# EAGLE schematic multiSPIschematic (EAGLE 9.1.0)
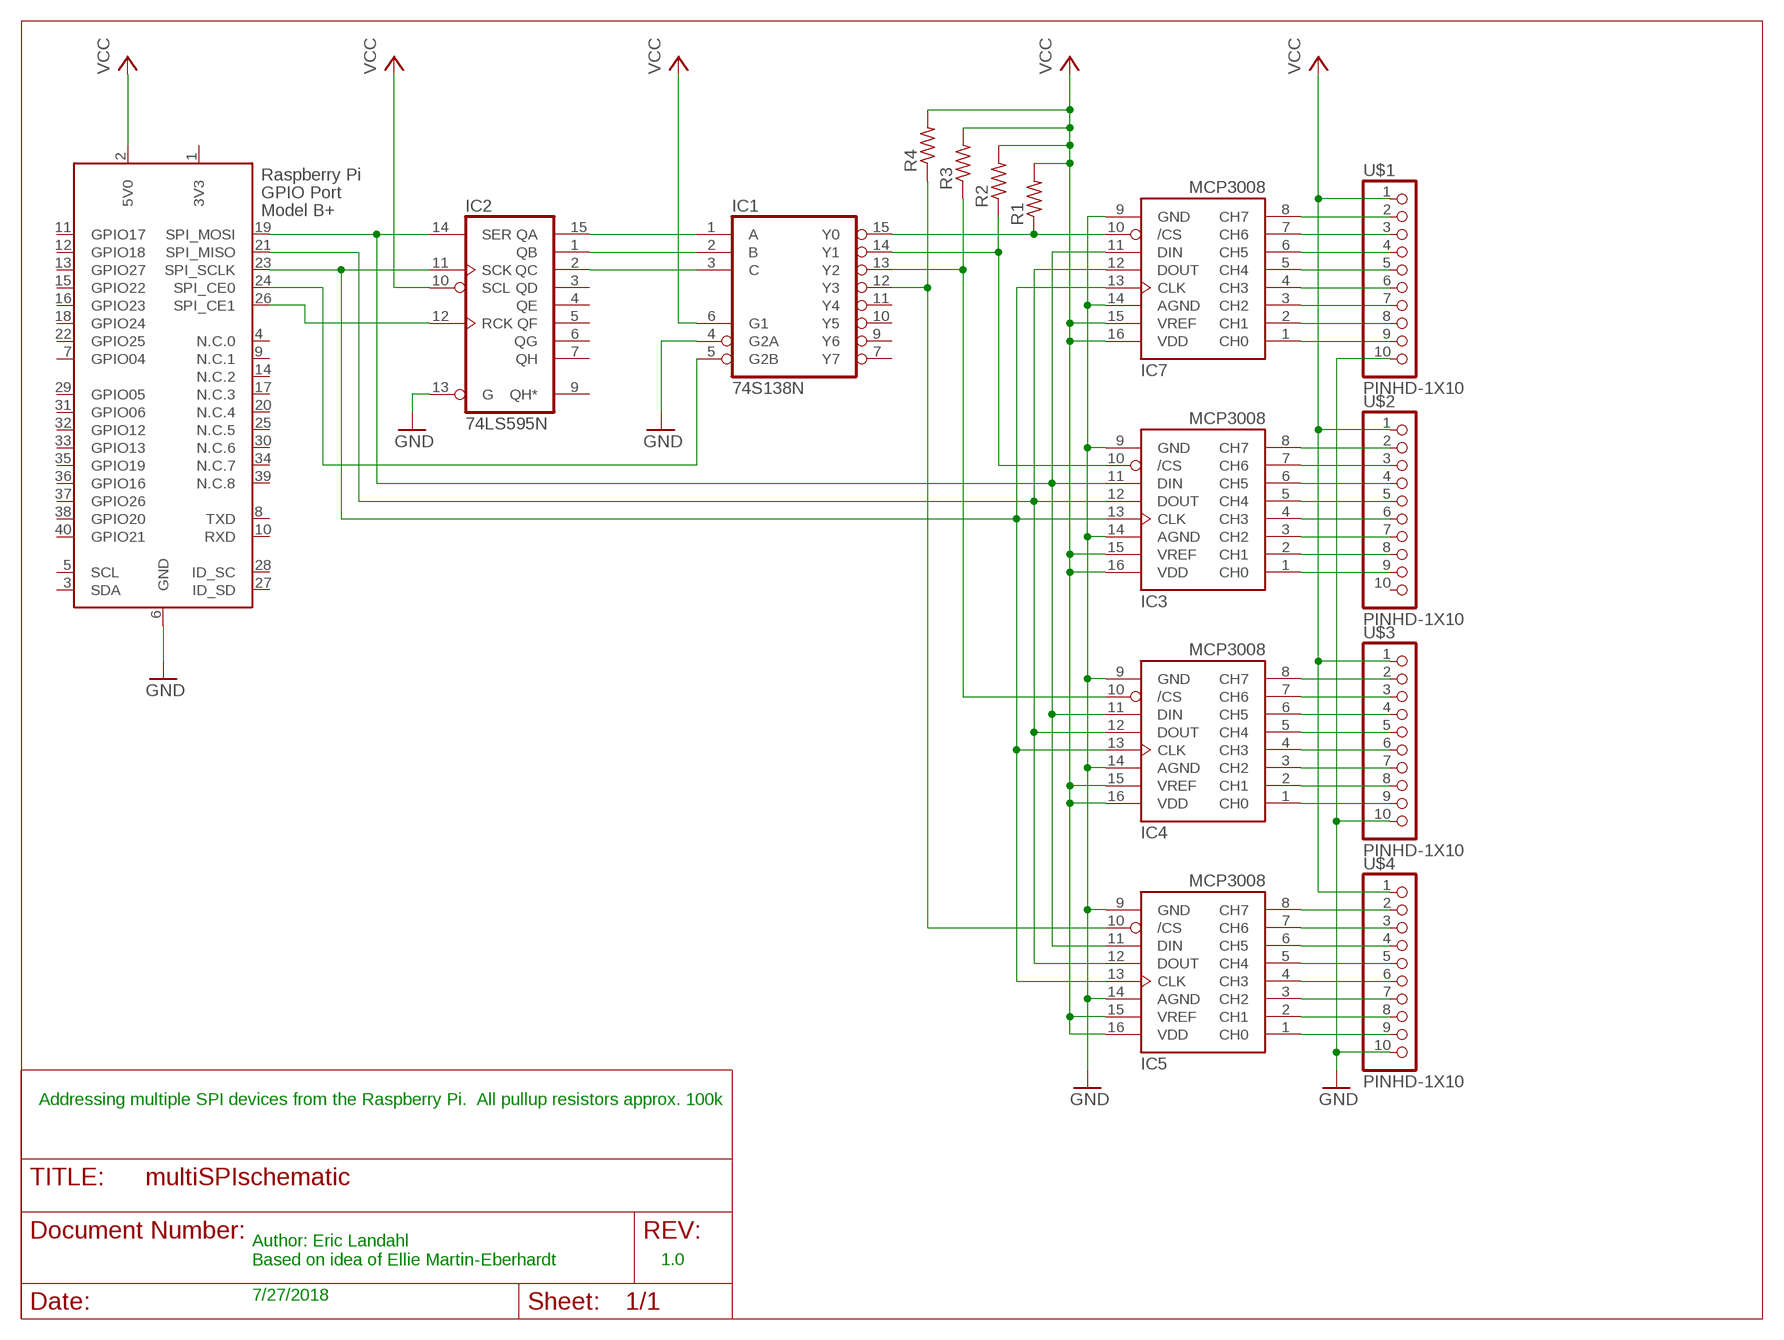
[diagram p0: schematic, sheet 1]

## Parts
IC1  74S138N  [DIL16]
IC2  74LS595N  [DIL16]
IC3  MCP3008  [DIL16]
IC4  MCP3008  [DIL16]
IC5  MCP3008  [DIL16]
IC7  MCP3008  [DIL16]
R1  R-US_0207/10  [0207/10]
R2  R-US_0207/10  [0207/10]
R3  R-US_0207/10  [0207/10]
R4  R-US_0207/10  [0207/10]
U$1  PINHD-1X10  [1X10-BIG]
U$2  PINHD-1X10  [1X10-BIG]
U$3  PINHD-1X10  [1X10-BIG]
U$4  PINHD-1X10  [1X10-BIG]
X1  RASPI_GPIO_B+_BOX  [RASPI_GPIO_B+_BOX]

## Nets
GND: IC1.4(G2A) IC2.13(G) IC3.9(GND) IC3.14(AGND) IC4.9(GND) IC4.14(AGND) IC5.9(GND) IC5.14(AGND) IC7.9(GND) IC7.14(AGND) U$1.10 U$3.10 U$4.10 X1.6(GND)
N$1: IC1.1(A) IC2.15(QA)
N$2: IC1.2(B) IC2.1(QB)
N$3: IC1.3(C) IC2.2(QC)
N$4: IC2.11(SCK) IC3.13(CLK) IC4.13(CLK) IC5.13(CLK) IC7.13(CLK) X1.23(SPI_SCLK)
N$5: IC3.12(DOUT) IC4.12(DOUT) IC5.12(DOUT) IC7.12(DOUT) X1.21(SPI_MISO)
N$6: IC1.15(Y0) IC7.10(/CS) R1.1
N$7: IC2.14(SER) IC3.11(DIN) IC4.11(DIN) IC5.11(DIN) IC7.11(DIN) X1.19(SPI_MOSI)
N$8: IC1.13(Y2) IC4.10(/CS) R3.1
N$9: IC1.14(Y1) IC3.10(/CS) R2.1
N$10: IC1.12(Y3) IC5.10(/CS) R4.1
N$11: IC2.12(RCK) X1.26(SPI_CE1)
N$12: IC7.8(CH7) U$1.2
N$13: IC7.7(CH6) U$1.3
N$14: IC7.6(CH5) U$1.4
N$15: IC1.5(G2B) X1.24(SPI_CE0)
N$16: IC7.5(CH4) U$1.5
N$17: IC7.4(CH3) U$1.6
N$18: IC7.3(CH2) U$1.7
N$19: IC7.2(CH1) U$1.8
N$20: IC7.1(CH0) U$1.9
N$21: IC3.8(CH7) U$2.2
N$22: IC3.7(CH6) U$2.3
N$23: IC3.6(CH5) U$2.4
N$24: IC3.5(CH4) U$2.5
N$25: IC3.4(CH3) U$2.6
N$26: IC3.3(CH2) U$2.7
N$27: IC3.2(CH1) U$2.8
N$28: IC3.1(CH0) U$2.9
N$29: IC4.1(CH0) U$3.9
N$30: IC4.2(CH1) U$3.8
N$31: IC4.3(CH2) U$3.7
N$32: IC4.4(CH3) U$3.6
N$33: IC4.5(CH4) U$3.5
N$34: IC4.6(CH5) U$3.4
N$35: IC4.7(CH6) U$3.3
N$36: IC4.8(CH7) U$3.2
N$37: IC5.1(CH0) U$4.9
N$38: IC5.2(CH1) U$4.8
N$39: IC5.3(CH2) U$4.7
N$40: IC5.4(CH3) U$4.6
N$41: IC5.5(CH4) U$4.5
N$42: IC5.6(CH5) U$4.4
N$43: IC5.7(CH6) U$4.3
N$44: IC5.8(CH7) U$4.2
VCC: IC1.6(G1) IC2.10(SCL) IC3.15(VREF) IC3.16(VDD) IC4.15(VREF) IC4.16(VDD) IC5.15(VREF) IC5.16(VDD) IC7.15(VREF) IC7.16(VDD) R1.2 R2.2 R3.2 R4.2 U$1.1 U$2.1 U$3.1 U$4.1 X1.2(5V0)
Unconnected: IC1.7(Y7) IC1.9(Y6) IC1.10(Y5) IC1.11(Y4) IC2.3(QD) IC2.4(QE) IC2.5(QF) IC2.6(QG) IC2.7(QH) IC2.9(QH*) U$2.10 X1.3(SDA) X1.4(N.C.0) X1.5(SCL) X1.7(GPIO04) X1.8(TXD) X1.9(N.C.1) X1.10(RXD) X1.11(GPIO17) X1.12(GPIO18) X1.13(GPIO27) X1.14(N.C.2) X1.15(GPIO22) X1.16(GPIO23) X1.17(N.C.3) X1.18(GPIO24) X1.20(N.C.4) X1.22(GPIO25) X1.25(N.C.5) X1.27(ID_SD) X1.28(ID_SC) X1.29(GPIO05) X1.30(N.C.6) X1.31(GPIO06) X1.32(GPIO12) X1.33(GPIO13) X1.34(N.C.7) X1.35(GPIO19) X1.36(GPIO16) X1.37(GPIO26) X1.38(GPIO20) X1.39(N.C.8) X1.40(GPIO21)

## Notes on the sheet
- Addressing multiple SPI devices from the Raspberry Pi.  All pullup resistors approx. 100k
- Author: Eric Landahl
  Based on idea of Ellie Martin-Eberhardt
- 1.0
- 7/27/2018

## Power pins joined to a net without a drawn wire
3V3: X1.1(3V3)
GND: IC1.8(GND) IC2.8(GND)
VCC: IC1.16(VCC) IC2.16(VCC)

## Library data of the parts
IC1 = 74xx-us:74*138: 3-line to 8-line DECODER/DEMULTIPLEXER
IC2 = 74xx-us:74*595: 8-bit SHIFT REGISTER, output latch
IC3-IC5 IC7 = adafruit:MCP3008
R1-R4 = adafruit:R-US_: RESISTOR, American symbol
U$1-U$4 = adafruit:PINHD-1X10: Pin header 1x10 0.1" spacing With round pins
X1 = raspberrypi_bastelstube_v13:RASPI_GPIO_B+: Only the 2x20 header connector, nothing else